# EAGLE schematic boardv1 (EAGLE 9.6.2)
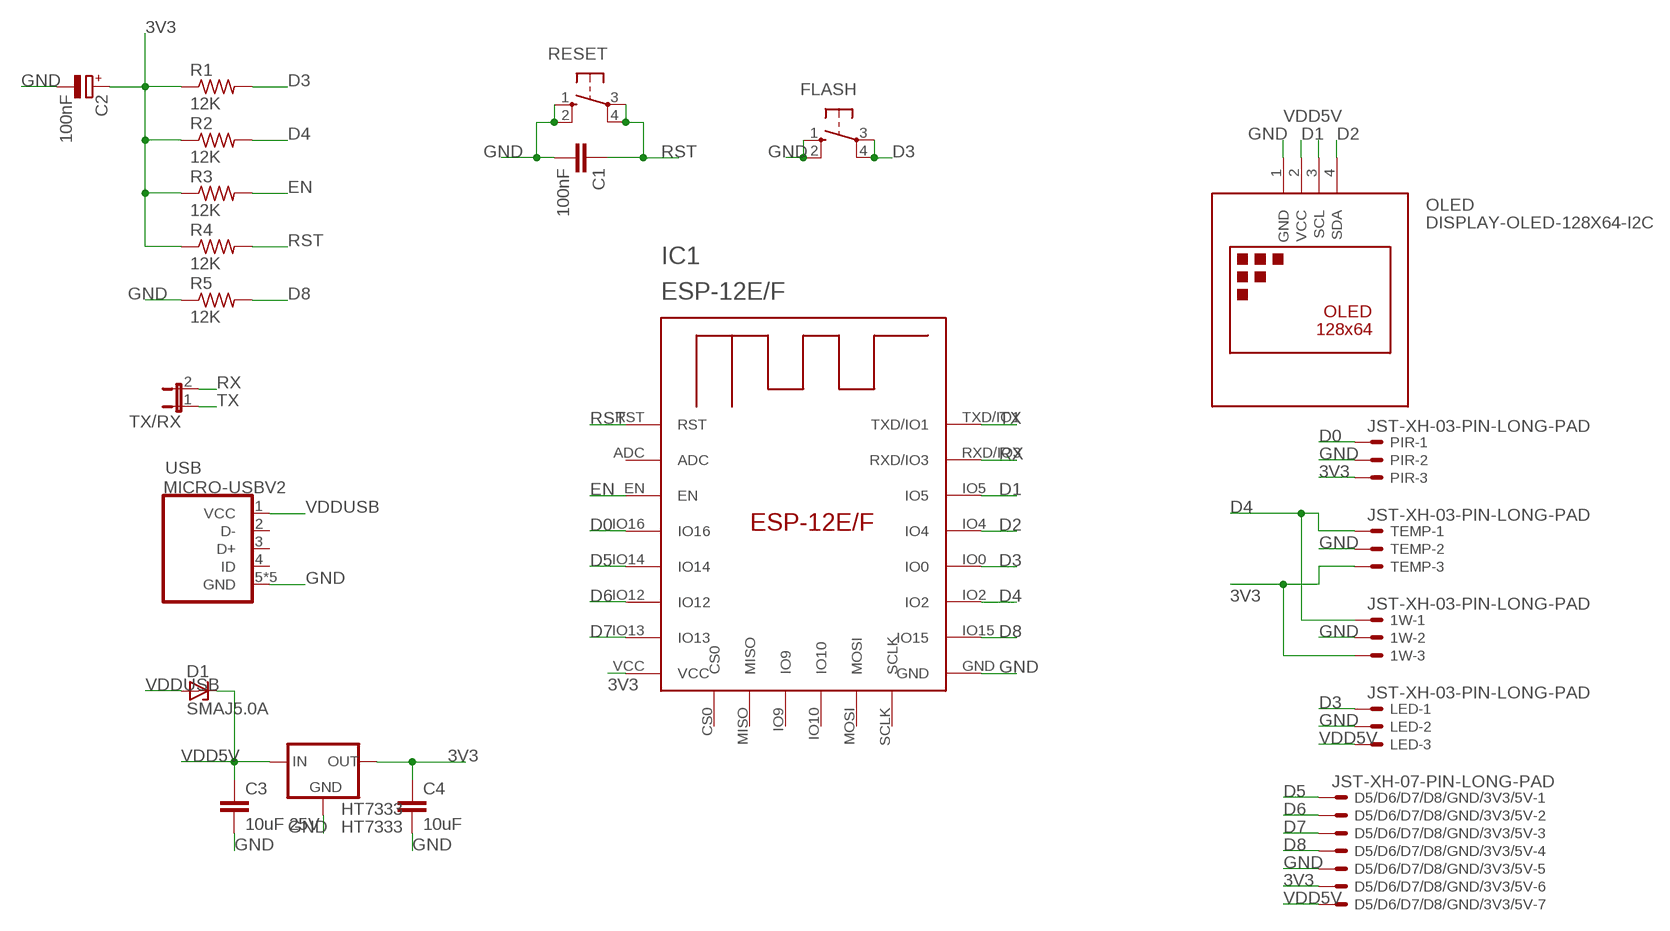
[diagram p0: schematic, sheet 1]

## Parts
1W  JST-XH-03-PIN-LONG-PAD  [JST-XH-03-PACKAGE-LONG-PAD]
C1  100nF  C-EUC0805  [C0805]
C2  100nF  CPOL-EUR/2012-12R  [R/2012-12R]
C3  10uF 25V  C-EUC0805  [C0805]
C4  10uF  C-EUC0805  [C0805]
D1  SMAJ5.0A  [DO214AC]
D5/D6/D7/D8/GND/3V3/5V  JST-XH-07-PIN-LONG-PAD  [JST-XH-07-PACKAGE-LONG-PAD]
FLASH  10-XX  [B3F-10XX]
HT7333  HT7333  [SOT-89]
IC1  ESP-12E/F  [ESP-12E]
LED  JST-XH-03-PIN-LONG-PAD  [JST-XH-03-PACKAGE-LONG-PAD]
OLED  DISPLAY-OLED-128X64-I2C  [DISPLAY-OLED-128X64-I2C]
PIR  JST-XH-03-PIN-LONG-PAD  [JST-XH-03-PACKAGE-LONG-PAD]
R1  12K  R-US_R1206  [R1206]
R2  12K  R-US_R1206  [R1206]
R3  12K  R-US_R1206  [R1206]
R4  12K  R-US_R1206  [R1206]
R5  12K  R-US_R1206  [R1206]
RESET  10-XX  [B3F-10XX]
TEMP  JST-XH-03-PIN-LONG-PAD  [JST-XH-03-PACKAGE-LONG-PAD]
TX/RX  JP1E  [JP1]
USB  MICRO-USBV2  [MICRO-USB-2]

## Nets
3V3: 1W.3 C2.+ C4.1 D5/D6/D7/D8/GND/3V3/5V.6 HT7333.1(OUT) IC1.VCC PIR.3 R1.1 R2.1 R3.1 R4.1 TEMP.3
D0: IC1.IO16 PIR.1
D1: IC1.IO5 OLED.3(SCL)
D2: IC1.IO4 OLED.4(SDA)
D3: FLASH.3(P) FLASH.4(P1) IC1.IO0 LED.1 R1.2
D4: 1W.1 IC1.IO2 R2.2 TEMP.1
D5: D5/D6/D7/D8/GND/3V3/5V.1 IC1.IO14
D6: D5/D6/D7/D8/GND/3V3/5V.2 IC1.IO12
D7: D5/D6/D7/D8/GND/3V3/5V.3 IC1.IO13
D8: D5/D6/D7/D8/GND/3V3/5V.4 IC1.IO15 R5.2
EN: IC1.EN R3.2
GND: 1W.2 C1.2 C2.- C3.2 C4.2 D5/D6/D7/D8/GND/3V3/5V.5 FLASH.1(S) FLASH.2(S1) HT7333.2(GND) IC1.GND LED.2 OLED.1(GND) PIR.2 R5.1 RESET.1(S) RESET.2(S1) TEMP.2 USB.5(GND) USB.P$1(GND) USB.P$2(GND) USB.P$3(GND) USB.P$4(GND)
RST: C1.1 IC1.RST R4.2 RESET.3(P) RESET.4(P1)
RX: IC1.RXD/IO3 TX/RX.2
TX: IC1.TXD/IO1 TX/RX.1
VDD5V: C3.1 D1.C D5/D6/D7/D8/GND/3V3/5V.7 HT7333.3(IN) HT7333.4(IN) LED.3 OLED.2(VCC)
VDDUSB: D1.A USB.1(VCC)
Unconnected: IC1.ADC IC1.CS0 IC1.IO9 IC1.IO10 IC1.MISO IC1.MOSI IC1.SCLK USB.2(D-) USB.3(D+) USB.4(ID)

## Library data of the parts
1W LED PIR TEMP = Rembrandt Electronics - JST XH Connectors v1-0:JST-XH-03-PIN: JST XH Connector 2 Pin Wire to board connector. Pitch: 2,54 mm, (0.100") Number of pins: 3 Created by Rembrandt Electronics www.rembrandtelectronics.com
C1 C3 C4 = resistor:C-EU: CAPACITOR, European symbol
C2 = resistor:CPOL-EU: POLARIZED CAPACITOR, European symbol
D1 = smaj_10:SMAJ*A: SMAJ Series TVS Diodes Source: http://www.littelfuse.com/~/media/electronics/datasheets/tvs_diodes/littelfuse_tvs_diode_smaj_datasheet.pdf.pdf; MF: Littelfuse; MPN: SMAJ5.0A; OC_FARNELL: 1827607; OC_NEWARK: 71J2029
D5/D6/D7/D8/GND/3V3/5V = Rembrandt Electronics - JST XH Connectors v1-0:JST-XH-07-PIN: JST XH Connector 2 Pin Wire to board connector. Pitch: 2,54 mm, (0.100") Number of pins: 7 Created by Rembrandt Electronics www.rembrandtelectronics.com
FLASH RESET = switch-omron:10-XX: OMRON SWITCH; MPN: B3F-1000; OC_FARNELL: 176432; OC_NEWARK: 36M3542
HT7333 = holtek2:HT73*
IC1 = esp-12e-f:ESP-12E/F
OLED = diy-modules:DISPLAY-OLED-128X64-I2C: 128x64 Dot Matrix OLED Module based on SSD1306 chip Variant with I2C interface More details available here: http://www.instructables.com/id/Monochrome-096-i2c-OLED-display-with-arduino-SSD13/ SSD1306 datasheet: https://cdn-shop.adafruit.com/datasheets/SSD1306.pdf Click here to find device on ebay.com <http://www.ebay.com/sch/oled+display+128x64+iic> Note: There are two variants: I2C and SPI. Search for the proper version.
R1 = resistor:R-US_: RESISTOR, American symbol; SPICEPREFIX: R
R2-R5 = resistor:R-US_: RESISTOR, American symbol
TX/RX = jumper:JP1E: JUMPER
USB = microusb:MICRO-USB: Micro USB B connector